# EAGLE design PowerBus (EAGLE 6.4)
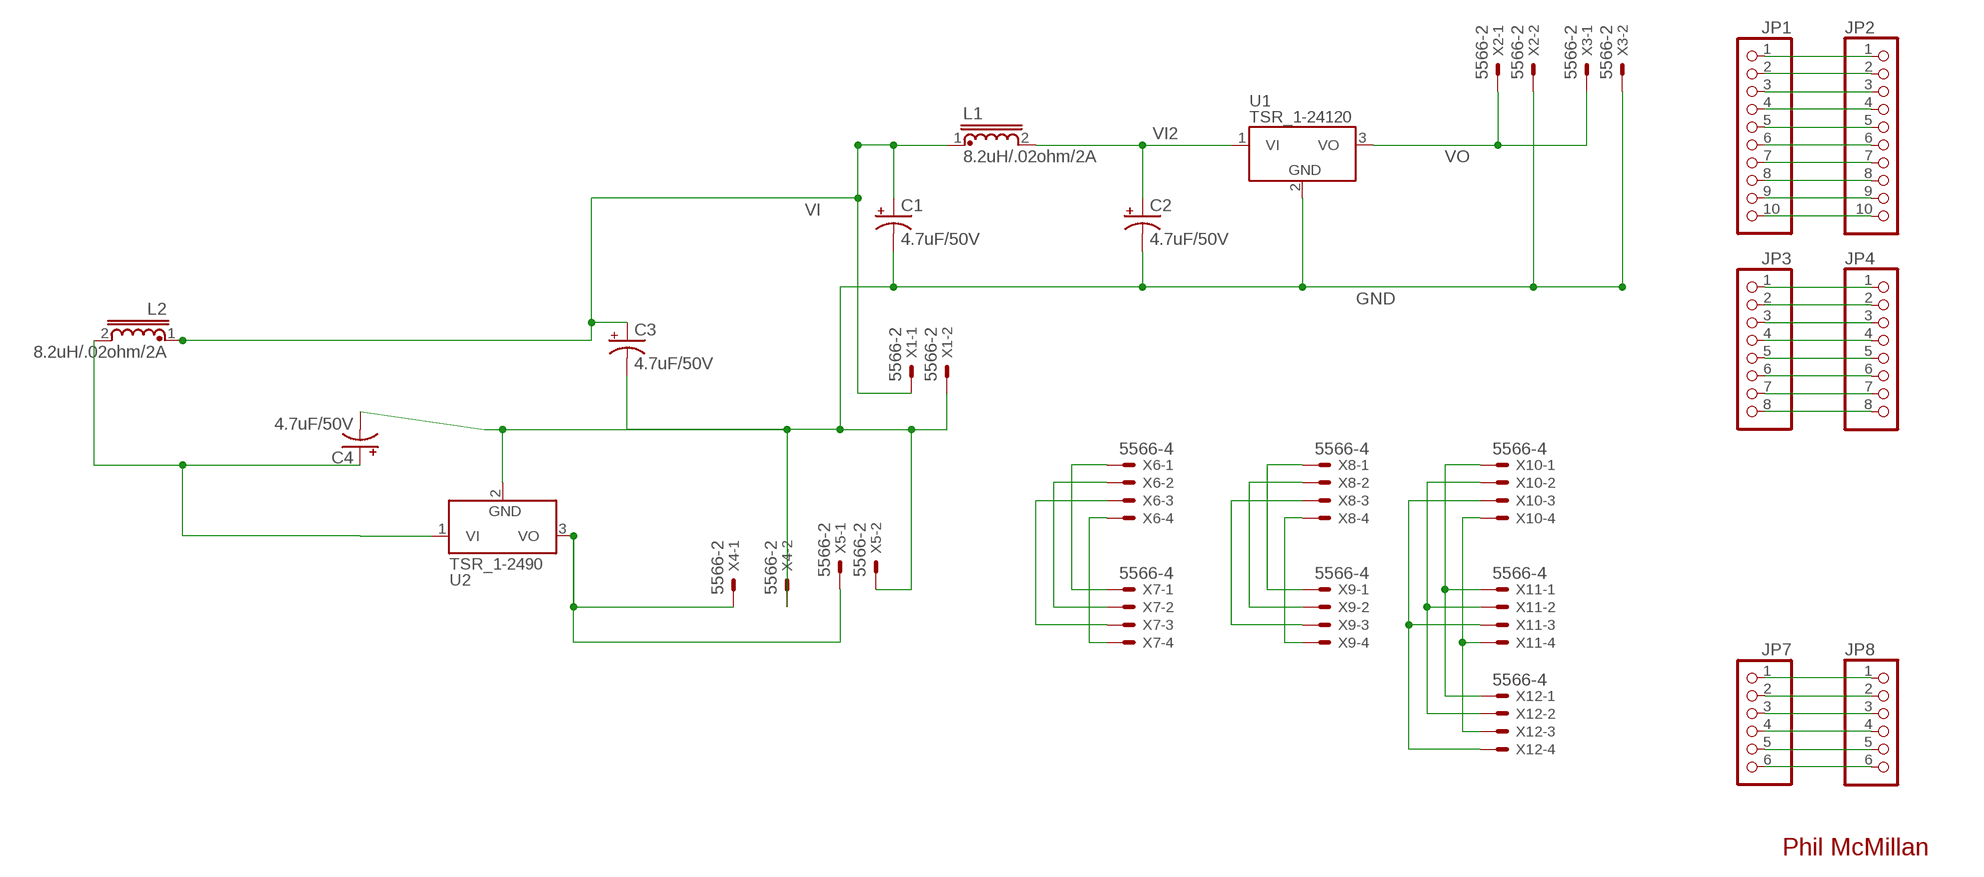
[diagram p0: schematic, sheet 1]

## Parts
C1  4.7uF/50V  CPOL-USE2-5  [E2-5]
C2  4.7uF/50V  CPOL-USE2-5  [E2-5]
C3  4.7uF/50V  CPOL-USE2-5  [E2-5]
C4  4.7uF/50V  CPOL-USE2-5  [E2-5]
JP1  PINHD-1X10  [1X10]
JP2  PINHD-1X10  [1X10]
JP3  PINHD-1X8  [1X08]
JP4  PINHD-1X8  [1X08]
JP7  PINHD-1X6  [1X06]
JP8  PINHD-1X6  [1X06]
L1  8.2uH/.02ohm/2A  MCAP103722016A-8R2MU  [MCAP103722016A-8R2MU]
L2  8.2uH/.02ohm/2A  MCAP103722016A-8R2MU  [MCAP103722016A-8R2MU]
U1  TSR_1-24120  [TSR-1]
U2  TSR_1-2490  [TSR-1]
X1  5566-2  [5566-2]
X2  5566-2  [5566-2]
X3  5566-2  [5566-2]
X4  5566-2  [5566-2]
X5  5566-2  [5566-2]
X6  5566-4  [5566-4]
X7  5566-4  [5566-4]
X8  5566-4  [5566-4]
X9  5566-4  [5566-4]
X10  5566-4  [5566-4]
X11  5566-4  [5566-4]
X12  5566-4  [5566-4]

## Nets
GND: C1.- C2.- C3.- C4.- U1.2(GND) U2.2(GND) X1.2 X2.2 X3.2 X4.2 X5.2
N$1: X6.1 X7.1
N$2: X6.2 X7.2
N$3: X6.3 X7.3
N$4: X6.4 X7.4
N$5: JP1.1 JP2.1
N$6: JP1.2 JP2.2
N$7: X8.1 X9.1
N$8: X8.2 X9.2
N$9: X8.3 X9.3
N$10: X8.4 X9.4
N$11: X10.1 X11.1 X12.1
N$12: X10.2 X11.2 X12.2
N$13: X10.3 X11.3 X12.4
N$14: X10.4 X11.4 X12.3
N$15: JP1.3 JP2.3
N$16: JP1.5 JP2.5
N$17: JP1.6 JP2.6
N$18: JP1.7 JP2.7
N$19: JP1.8 JP2.8
N$20: JP1.9 JP2.9
N$21: JP1.10 JP2.10
N$22: JP1.4 JP2.4
N$24: JP3.1 JP4.1
N$25: JP3.2 JP4.2
N$26: JP3.3 JP4.3
N$27: JP3.4 JP4.4
N$28: JP3.5 JP4.5
N$29: JP3.6 JP4.6
N$30: JP3.7 JP4.7
N$31: JP3.8 JP4.8
N$39: JP7.1 JP8.1
N$40: JP7.2 JP8.2
N$41: JP7.3 JP8.3
N$42: JP7.4 JP8.4
N$43: JP7.5 JP8.5
N$44: JP7.6 JP8.6
VI: C1.+ C3.+ L1.1 L2.1 X1.1
VI2: C2.+ L1.2 U1.1(VI)
VI3: C4.+ L2.2 U2.1(VI)
VO: U1.3(VO) X2.1 X3.1
VO2: U2.3(VO) X4.1 X5.1

## Notes on the sheet
- Phil McMillan

## Library data of the parts
C1-C4 = rcl:CPOL-US: POLARIZED CAPACITOR, American symbol
JP1 JP2 = pinhead:PINHD-1X10: PIN HEADER
JP3 JP4 = pinhead:PINHD-1X8: PIN HEADER
JP7 JP8 = pinhead:PINHD-1X6: PIN HEADER
L1 L2 = inductor-multicomp:MCAP103722016A-8R2MU: INDUCTOR
U1 U2 = _traco_tsr-1:TSR_1-*: TRACO TSR-1 Series Point-of-Load DC/DC-Converters Vi max. 36 V; Vo = (1.2 .. 15)V ±2%; Io = 0 .. 1 A SIP-Package (drop-in replacement for 78xx linear voltage regulators in TO220-package, vertically assembled) Source: www.tracopower.com Technologies: TSR 1- Vi (V) Vo (V) ±2% Io = 0 .. 1 A 24_ ( generic ) 2412 4.6 .. 36 1.2 2415 4.6 .. 36 1.5 2418 4.6 .. 36 1.8 2425 4.6 .. 36 2.5 2433 4.75.. 36 3.3 2450 6.5 .. 36 5.0 2465 9.0 .. 36 6.5 2490 12 .. 36 9.0 24120 15 .. 36 12 24150 18 .. 36 15 Author: Dipl.-Ing. FH Rainer Bayer HHN Hochschule Heilbronn, rainer.bayer@hs-heilbronn.de Ingenieurbüro ing-rb, mail@ing-rb.de
X1-X5 = con-molex:5566-2: Mini FIT connector 2 pol Source: http://www.molex.com; OC_FARNELL: 1822072; OC_NEWARK: unknown
X6-X12 = con-molex:5566-4: Mini FIT connector 4 pol Source: http://www.molex.com; OC_FARNELL: unknown; OC_NEWARK: unknown

## Board
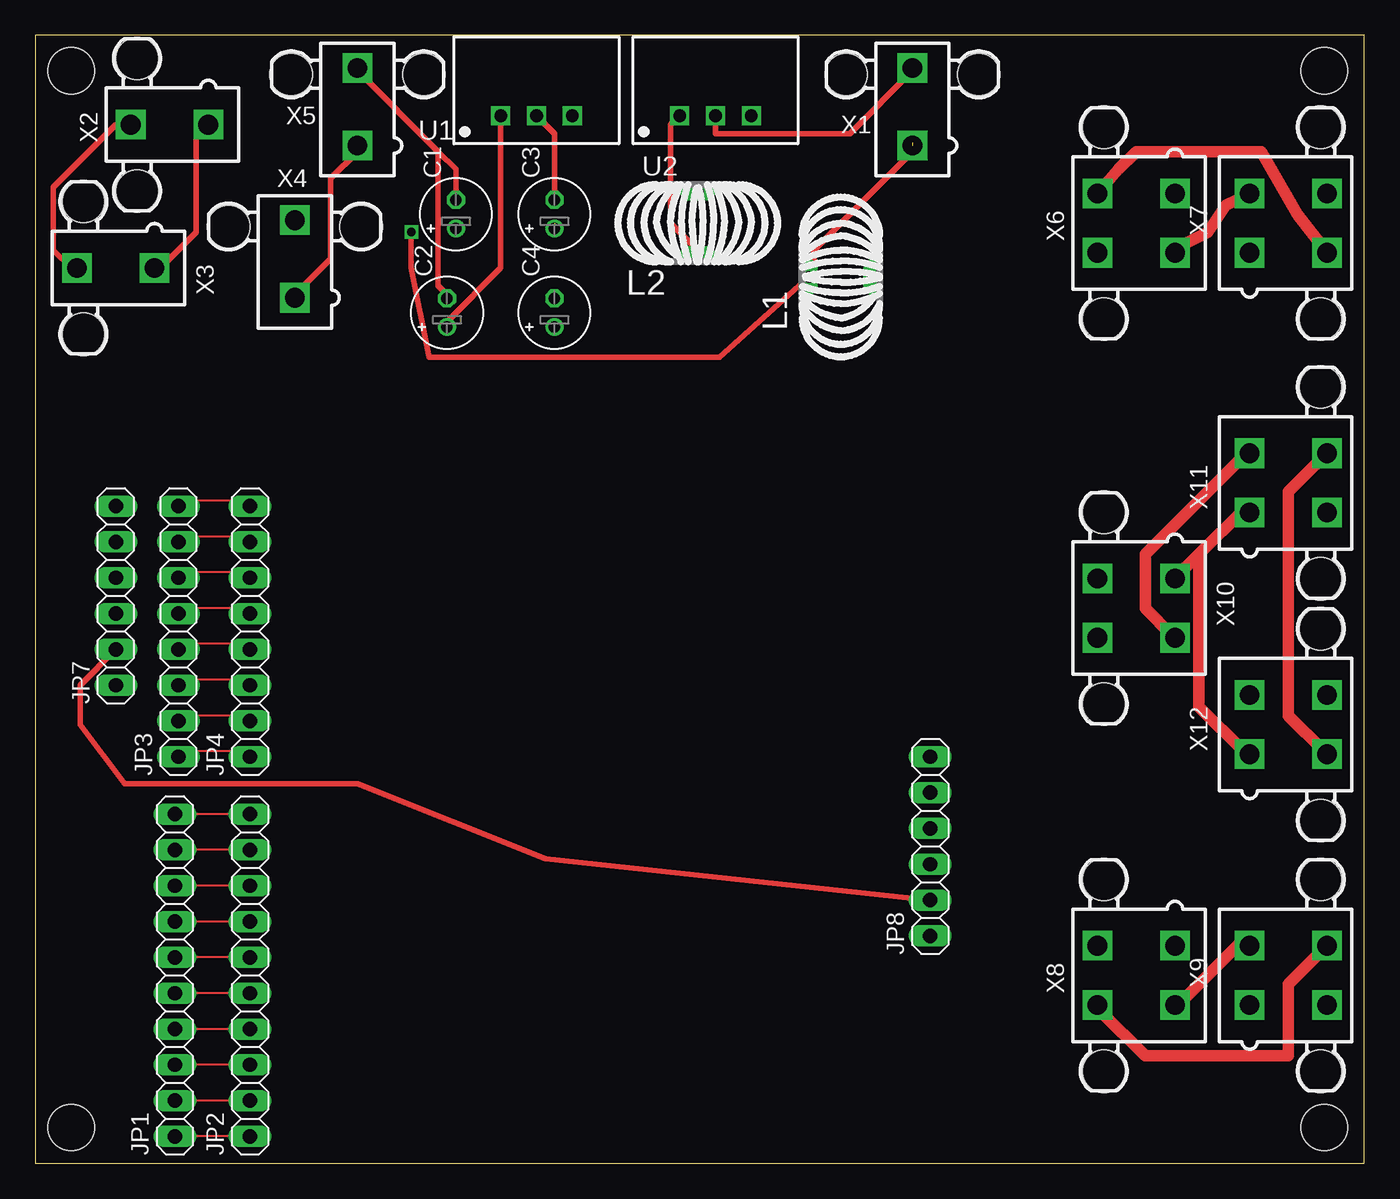
[diagram p1: board, top side]
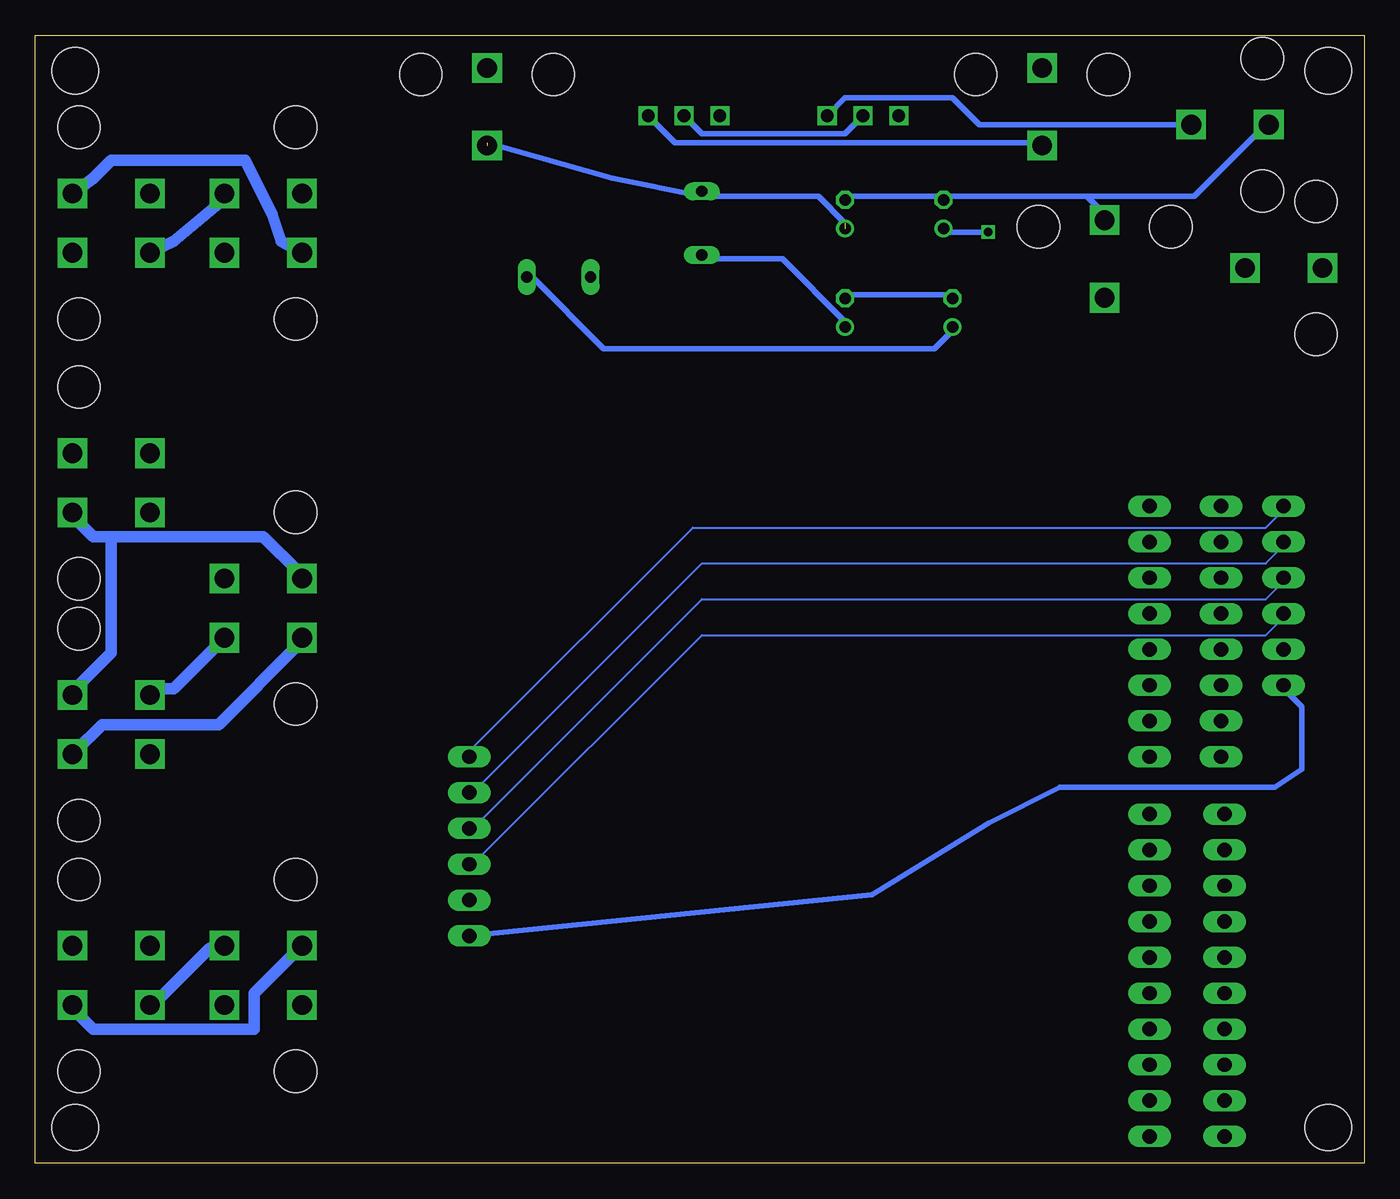
[diagram p2: board, bottom side, seen from below]

Size 94.28 x 80 mm. Coordinates in mm from the lower left corner, seen from the top.
Outline: 0,0 94.28,0 94.28,80 0,80 0,0
Copper layers (1*16): Top 0.0356mm / dielectric 1.5011mm / Bottom 0.0356mm
Design rules "LaenPCBOrder *": minimum track width 6mil, minimum drill 13mil, track to track 6mil, track to pad 6mil, pad to pad 6mil, via to via 6mil, smd to smd 6mil, copper to edge 15mil, drill to drill 6mil, minimum pad ring 7mil, minimum via ring 7mil, stop-mask expansion 3mil, vias tented up to drill 0mil, thermal gap 10mil

### Footprints (pad centres in the part's own frame; a part is rotated, then mirrored left to right if it is on the bottom)
E2-5 = drill 0.813 pad 1.27: + -1.016,0 | drill 0.813 pad 1.27 octagon: - 1.016,0
1X10 = drill 1.016 long: 1 -11.43,0; 2 -8.89,0; 3 -6.35,0; 4 -3.81,0; 5 -1.27,0; 6 1.27,0; 7 3.81,0; 8 6.35,0; 9 8.89,0; 10 11.43,0
1X08 = drill 1.016 long: 1 -8.89,0; 2 -6.35,0; 3 -3.81,0; 4 -1.27,0; 5 1.27,0; 6 3.81,0; 7 6.35,0; 8 8.89,0
1X06 = drill 1.016 long: 1 -6.35,0; 2 -3.81,0; 3 -1.27,0; 4 1.27,0; 5 3.81,0; 6 6.35,0
MCAP103722016A-8R2MU = drill 0.813 pad 1.27 long: 1 0,2.261; 2 0,-2.261
TSR-1 = drill 0.9 square: 1 -2.54,0; 2 0,0; 3 2.54,0
STAND-OFF = hole 3.302: 0,0
5566-2 = drill 1.4 square: 1 0,-2.75; 2 0,2.75 | hole 3: 4.7,2.29; -4.7,2.29
5566-4 = drill 1.4 square: 1 2.1,-2.75; 2 -2.1,-2.75; 3 2.1,2.75; 4 -2.1,2.75 | hole 3: 6.8,2.29; -6.8,2.29

### Placement (x,y rotation side)
C1  29.84,67.31 90 top
C2  29.21,60.33 90 top
C3  36.83,67.31 90 top
C4  36.83,60.33 90 top
JP1  9.91,13.34 90 top
JP2  15.24,13.34 90 top
JP3  10.16,37.72 90 top
JP4  15.24,37.72 90 top
JP7  5.71,40.26 90 top
JP8  63.5,22.48 90 top
L1  57.15,62.87 90 top
L2  46.99,66.67 0 top
U1  35.56,74.3 0 top
U2  48.26,74.3 0 top
U$1  [STAND-OFF]  2.54,77.47 0 bottom
U$2  [STAND-OFF]  2.54,2.54 0 top
U$4  [STAND-OFF]  91.44,77.47 0 top
U$5  [STAND-OFF]  91.44,2.54 0 bottom
X1  62.23,74.93 0 top
X2  9.53,73.66 90 top
X3  5.71,63.5 90 top
X4  18.41,64.14 0 top
X5  22.86,74.93 0 top
X6  78.11,66.67 90 top
X7  88.9,66.67 270 top
X8  78.11,13.34 90 top
X9  88.9,13.34 270 top
X10  78.11,39.37 90 top
X11  88.9,48.26 270 top
X12  88.9,31.11 270 top

### Tracks (layer width: path | path; a pad name or v marks a point on that pad's centre or on a via)
GND
  Top 0.406: X3.2 2.54,63.5 1.27,64.77 1.27,69.22 5.71,73.66 6.35,73.66 X2.2 | U1.2 36.83,73.03 36.83,68.58 C3.- | 28.57,71.75 29.84,70.48 29.84,68.58 C1.- | 28.57,71.75 22.86,77.47 X5.2 | U2.2 48.26,73.03 57.78,73.03 62.23,77.47 X1.2 | 28.57,71.75 28.57,62.23 29.21,61.59 C2.-
  Bottom 0.406: C2.- 29.21,61.59 36.83,61.59 C4.- | 29.84,68.58 36.83,68.58 C3.- | 29.84,68.58 C1.- 29.84,68.58 | U2.2 46.99,73.03 36.83,73.03 U1.2 | 19.68,68.58 18.41,67.31 X4.2 | 29.84,68.58 19.68,68.58 | 19.68,68.58 12.06,68.58 6.99,73.66 X2.2
N$1
  Bottom 0.813: X6.1 80.64,68.58 84.45,65.41 X7.1
N$2
  Top 0.813: X6.2 80.64,64.77 83.19,66.04 84.45,67.94 X7.2
N$3
  Top 0.813: X6.3 76.83,70.48 78.11,71.75 87,71.75 89.53,67.31 X7.3
N$4
  Bottom 0.813: X6.4 76.83,65.41 77.47,67.31 79.38,71.12 88.9,71.12 90.17,69.85 X7.4
N$5
  Top 0.152: JP2.1 10.16,1.91 JP1.1
N$6
  Top 0.152: JP2.2 10.16,4.45 JP1.2
N$7
  Bottom 0.813: X9.1 85.72,11.43 81.92,15.24 81.28,15.24 X8.1
N$8
  Top 0.813: X8.2 81.28,11.43 85.72,15.88 X9.2
N$9
  Bottom 0.813: X8.3 75.56,15.24 78.74,12.06 78.74,9.53 90.17,9.53 91.44,10.79 X9.3
N$10
  Top 0.813: X8.4 75.56,10.79 78.74,7.62 88.9,7.62 88.9,12.7 91.44,15.24 X9.4
N$11
  Top 0.813: 82.55,43.18 85.72,46.35 X11.1 | 82.55,43.18 81.28,41.91 X10.1 | 82.55,43.18 82.55,32.38 85.72,29.21 X12.1
N$12
  Top 0.813: X11.2 85.72,50.16 78.74,43.18 78.74,39.37 80.64,37.47 X10.2
  Bottom 0.813: X10.2 81.28,36.83 84.45,33.66 85.72,33.66 X12.2
N$13
  Bottom 0.813: 88.9,44.45 90.17,44.45 91.44,45.72 X11.3 | 88.9,44.45 78.11,44.45 75.56,41.91 X10.3 | 88.9,44.45 88.9,36.2 91.44,33.66 X12.4
N$14
  Top 0.813: X11.4 91.44,50.16 88.9,47.62 88.9,31.75 91.44,29.21 X12.3
  Bottom 0.813: X10.4 75.56,36.83 81.28,31.11 89.53,31.11 91.44,29.21 X12.3
N$15
  Top 0.152: JP2.3 10.16,6.99 JP1.3
N$16
  Top 0.152: JP2.5 10.16,12.06 JP1.5
N$17
  Top 0.152: JP2.6 10.16,14.61 JP1.6
N$18
  Top 0.152: JP2.7 10.16,17.14 JP1.7
N$19
  Top 0.152: JP2.8 10.16,19.68 JP1.8
N$20
  Top 0.152: JP2.9 10.16,22.23 JP1.9
N$21
  Top 0.152: JP2.10 10.16,24.77 JP1.10
N$22
  Top 0.152: JP2.4 10.16,9.53 JP1.4
N$24
  Top 0.152: JP3.1 10.16,29.21 15.24,29.21 JP4.1
N$25
  Top 0.152: JP3.2 10.16,31.75 15.24,31.75 JP4.2
N$26
  Top 0.152: JP3.3 10.16,34.29 15.24,34.29 JP4.3
N$27
  Top 0.152: JP3.4 10.16,36.83 15.24,36.83 JP4.4
N$28
  Top 0.152: JP3.5 10.16,39.37 15.24,39.37 JP4.5
N$29
  Top 0.152: JP3.6 10.16,41.91 15.24,41.91 JP4.6
N$30
  Top 0.152: JP3.7 10.16,44.45 15.24,44.45 JP4.7
N$31
  Top 0.152: JP3.8 10.16,46.99 15.24,46.99 JP4.8
N$39
  Bottom 0.152: 5.71,33.66 JP7.1
  Bottom 0.406: 5.71,33.66 4.45,32.38 4.45,29.21 4.45,27.94 6.35,26.67 21.59,26.67 26.67,24.13 34.92,19.05 JP8.1
N$40
  Top 0.381: 3.17,31.11 6.35,26.92
  Top 0.406: JP7.2 3.17,33.91 3.17,31.11 | JP8.2 36.2,21.59 22.86,26.92 6.35,26.92
N$41
  Bottom 0.152: JP7.3 5.71,38.73 6.99,37.47 46.99,37.47 62.87,21.59 63.5,21.59 JP8.3
N$42
  Bottom 0.152: JP7.4 5.71,41.27 6.99,40.01 46.99,40.01 62.87,24.13 63.5,24.13 JP8.4
N$43
  Bottom 0.152: JP7.5 5.71,43.81 6.99,42.55 46.99,42.55 62.87,26.67 63.5,26.67 JP8.5
N$44
  Bottom 0.152: JP7.6 5.71,46.35 6.99,45.09 47.62,45.09 63.5,29.21 JP8.6
VI  (via drill 0.6)  (2 unrouted)
  Top 0.406: X1.1 62.23,71.75 55.24,64.77 55.24,62.87 L1.1 48.54,57.15 46.35,57.15 27.94,57.15 26.67,63.5 v26.67,66.04
  Bottom 0.406: C1.+ 29.84,66.04 27.3,66.04 v26.67,66.04 | C3.+ 36.83,66.67 38.73,68.58 46.99,68.58 | 46.99,68.58 53.34,69.85 62.23,72.39 | 46.99,68.58 L2.1
VI2
  Top 0.406: U1.1 33.02,63.5 29.21,59.69 C2.+
  Bottom 0.406: L1.2 59.05,62.87 53.98,57.78 30.48,57.78 29.21,59.05 C2.+
VI3
  Top 0.406: U2.1 45.09,73.66 45.09,66.67 46.99,64.77 L2.2
  Bottom 0.406: C4.+ 36.83,59.69 41.27,64.14 46.99,64.14 L2.2
VO
  Top 0.406: X3.1 8.89,63.5 11.43,66.04 11.43,73.03 12.06,73.66 X2.1
  Bottom 0.406: U1.3 36.83,75.56 29.21,75.56 27.3,73.66 12.7,73.66 X2.1
VO2
  Top 0.406: X4.1 18.41,61.59 20.95,64.14 20.95,69.85 22.86,71.75 X5.1
  Bottom 0.406: U2.3 48.9,72.39 22.86,72.39 X5.1